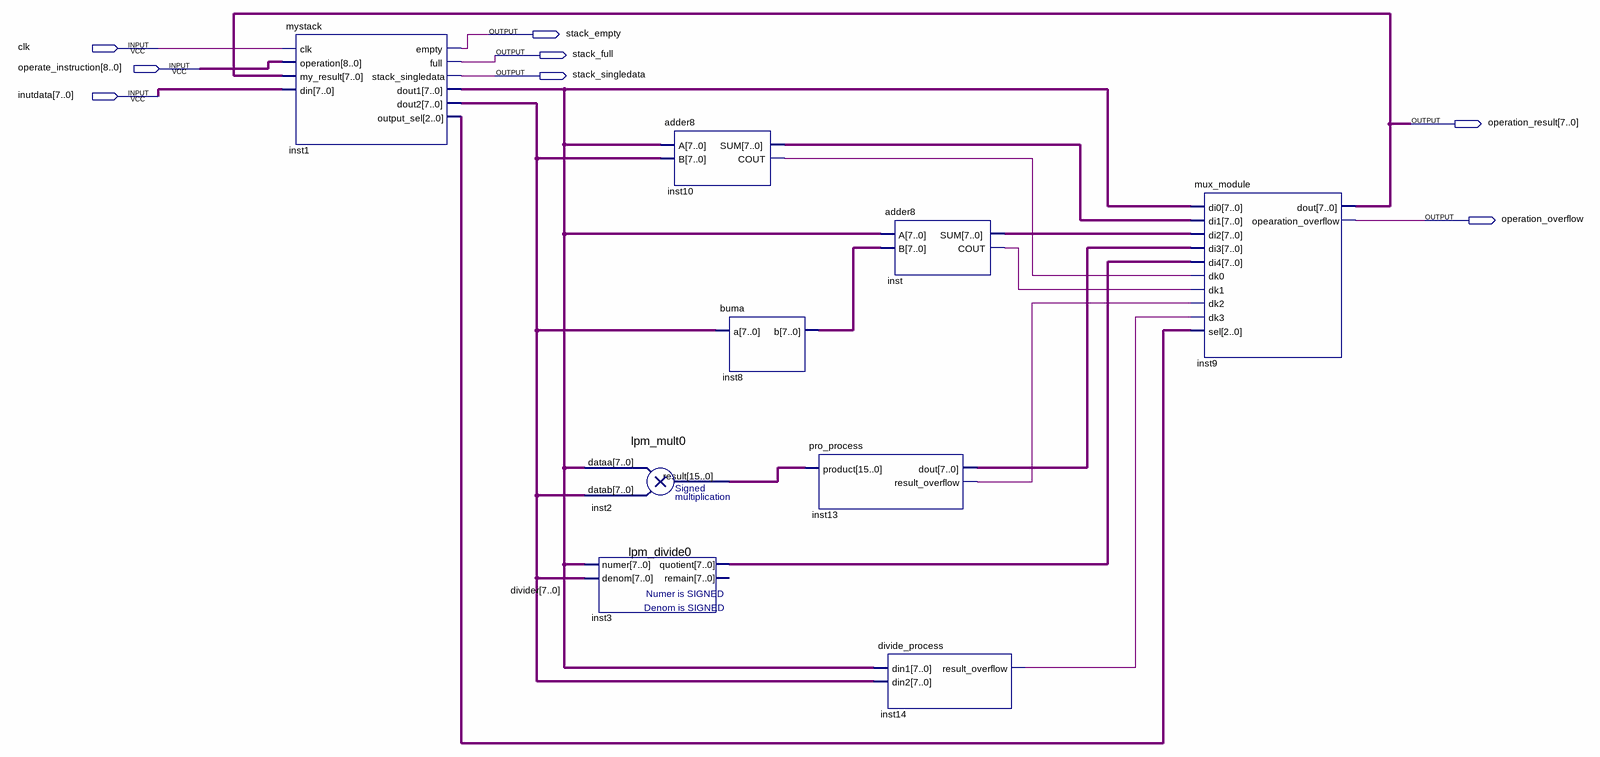
[diagram p0: schematic sheet]
// Quartus schematic calculator.bdf as structural Verilog: 9 symbols, 8 pins
module calculator (
  input  clk,
  input  [8:0] operate_instruction,
  input  [7:0] inutdata,
  output stack_empty,
  output stack_full,
  output stack_singledata,
  output [7:0] operation_result,
  output operation_overflow
);

  wire inst10_cout, inst13_result_overflow, inst14_result_overflow, inst_cout;
  wire [2:0] inst1_output_sel;
  wire [7:0] divider, inst1_dout1, inst3_quotient, inst8_b, inst10_sum, inst13_dout, inst_sum;
  wire [15:0] inst2_result;

  mystack inst1 (
    .clk(clk), .operation(operate_instruction), .my_result(operation_result), .din(inutdata),
    .empty(stack_empty), .full(stack_full), .stack_singledata(stack_singledata), .dout1(inst1_dout1),
    .dout2(divider), .output_sel(inst1_output_sel));
  lpm_mult0 inst2 (.dataa(inst1_dout1), .datab(divider), .result(inst2_result));
  lpm_divide0 inst3 (.numer(inst1_dout1), .denom(divider), .quotient(inst3_quotient));  // open: remain
  adder8 inst10 (.A(inst1_dout1), .B(divider), .SUM(inst10_sum), .COUT(inst10_cout));
  buma inst8 (.a(divider), .b(inst8_b));
  pro_process inst13 (.product(inst2_result), .dout(inst13_dout), .result_overflow(inst13_result_overflow));
  adder8 inst (.A(inst1_dout1), .B(inst8_b), .SUM(inst_sum), .COUT(inst_cout));
  divide_process inst14 (.din1(inst1_dout1), .din2(divider), .result_overflow(inst14_result_overflow));
  mux_module inst9 (
    .di0(inst1_dout1), .di1(inst10_sum), .di2(inst_sum), .di3(inst13_dout), .di4(inst3_quotient),
    .dk0(inst10_cout), .dk1(inst_cout), .dk2(inst13_result_overflow), .dk3(inst14_result_overflow),
    .sel(inst1_output_sel), .dout(operation_result), .opearation_overflow(operation_overflow));
endmodule
